# Altium schematic sheet WL-CONTROL.SchDoc
size 420 x 297 mm; Scale: 1:1; DocumentType: Схема электрическая принципиальная; FirstReferrence: UA3REO/R7KBI; DocumentNumber: 9; SheetNumber: 7; SheetTotal: 12
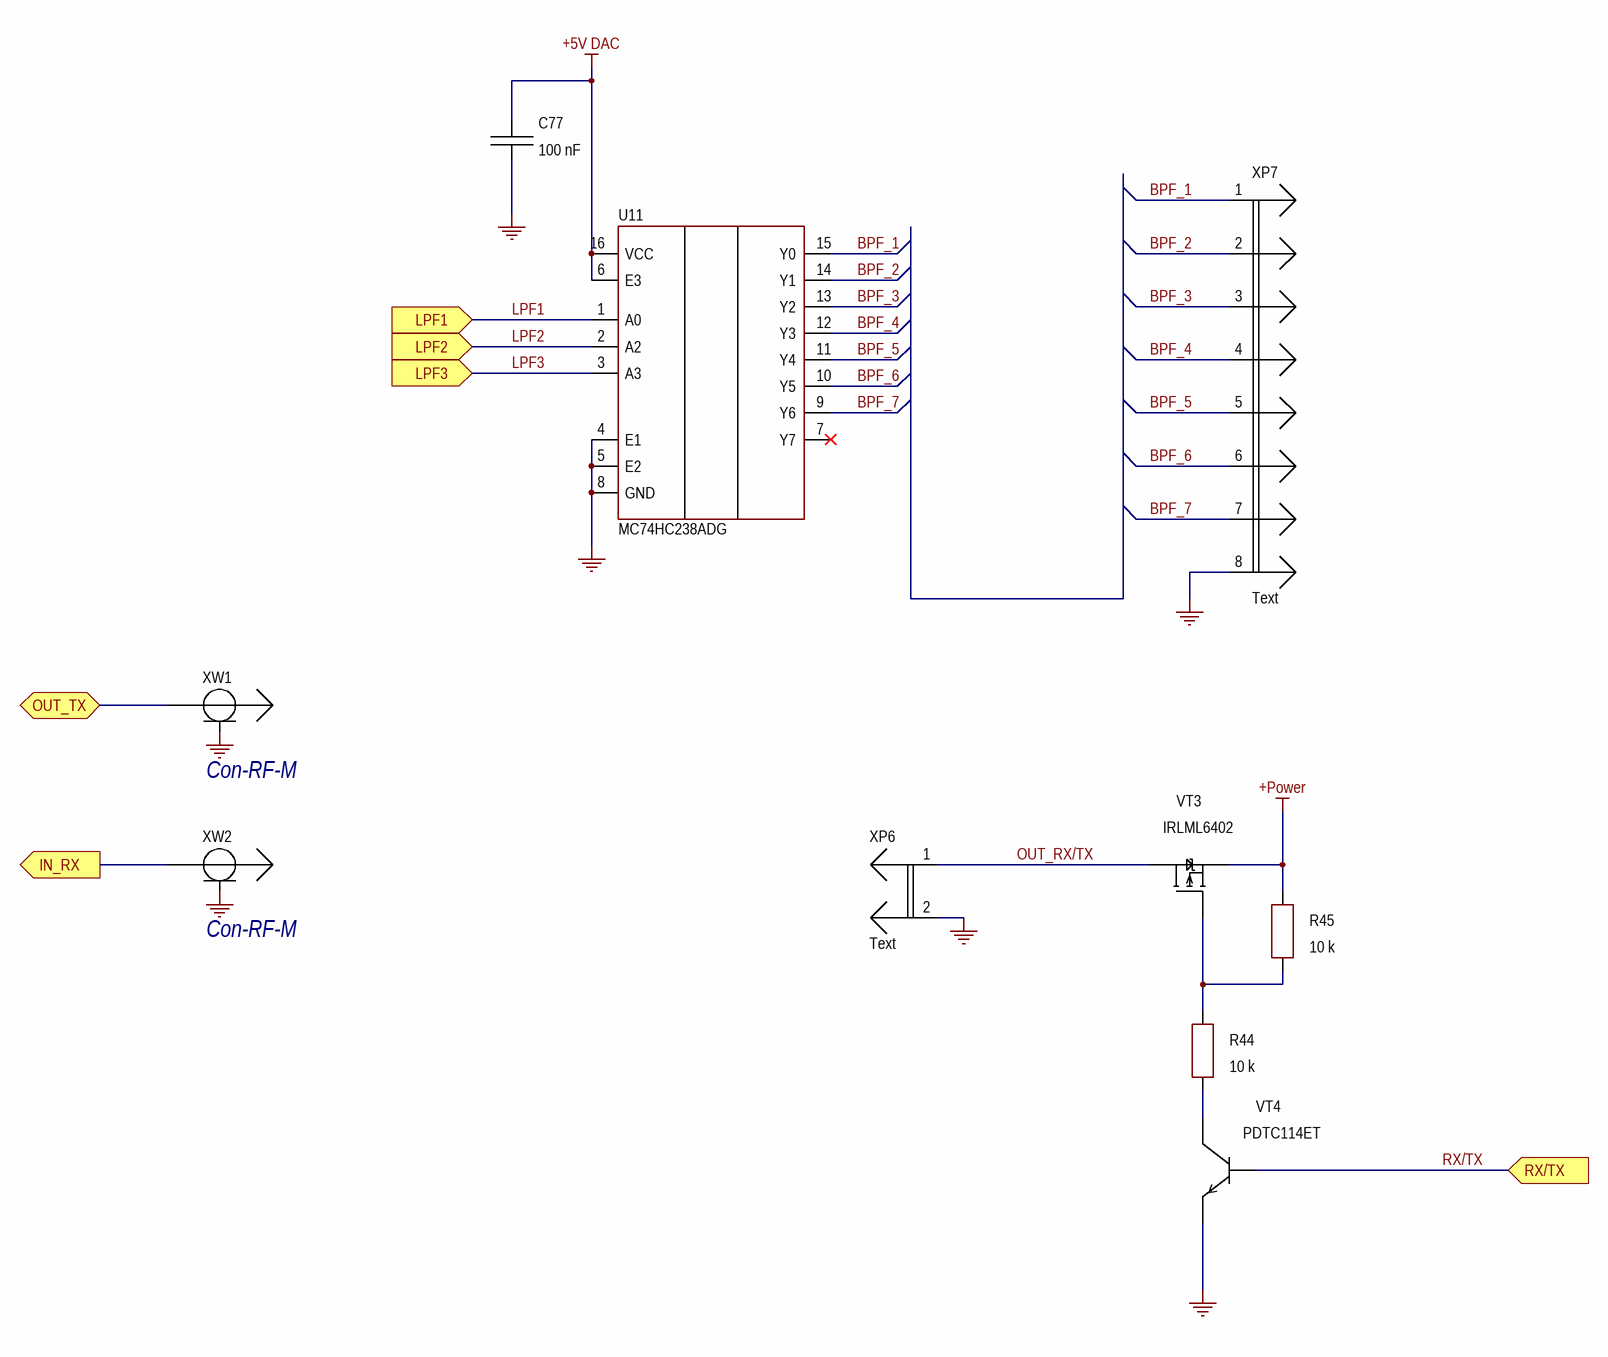
[diagram p0: WL-CONTROL.SchDoc]

## Parts
C77  100 nF  [C-0805-0.95]
R44  10 k  [R-0805]
R45  10 k  [R-0805]
U11  MC74HC238ADG  [SOIC-16]
VT3  IRLML6402  [SOT-23]
VT4  PDTC114ET  [SOT-23]
XP6  Text  [61900211121]
XP7  Text  [CON PLD-8]
XW1  Con-RF-M  [A-1JB]
XW2  Con-RF-M  [A-1JB]

## Ports
IN_RX (out), LPF1 (in), LPF2 (in), LPF3 (in), OUT_TX (bidir), RX/TX (in)

## Nets
+5V DAC: C77.1 U11.6(E3) U11.16(VCC)
+Power: R45.2 VT3.2(S)
GND: C77.2 U11.4(E1) U11.5(E2) U11.8(GND) VT4.2 XP6.2 XP7.8 XW1.2 XW2.2
BPF_1: U11.15(Y0) XP7.1
BPF_2: U11.14(Y1) XP7.2
BPF_3: U11.13(Y2) XP7.3
BPF_4: U11.12(Y3) XP7.4
BPF_5: U11.11(Y4) XP7.5
BPF_6: U11.10(Y5) XP7.6
BPF_7: U11.9(Y6) XP7.7
IN_RX: XW2.1 ; port IN_RX
LPF1: U11.1(A0) ; port LPF1
LPF2: U11.2(A2) ; port LPF2
LPF3: U11.3(A3) ; port LPF3
OUT_RX/TX: VT3.3(D) XP6.1
OUT_TX: XW1.1 ; port OUT_TX
RX/TX: VT4.1 ; port RX/TX
NetR44_1: R44.1 VT4.3
NetR44_2: R44.2 R45.1 VT3.1(G)

Not connected (* = marked no-connect by the designer): U11 7(Y7)*

## Notes on the sheet
- Подп. дата
- Инв. № дубл.
- Взам. инв. №
- Подп. и дата
- Инв. № подл.
- Изм.
- Лист
- № докум.
- Подп.
- Дата
- ALTIUM GOSTBOM2.0 KEV
- Файл:
- Копировал
- Формат А3

## Library data of the parts
C77 = CC0805KRX7R9BB104: Manufacturer: Yageo; Value: 100; Type: Конденсатор; Dielectric: X7R; Tolerance: ±10%; Voltage: 50 V; CommentDOC: ( CC - 0805 - X7R - 50 V - 100 nF ±10% ); Part Number: CC0805KRX7R9BB104; Units: nF; Case: 0805; Operating Temperature: -55 ... 125 °C; Series: CC; Value+Units: 100 nF; ValueSCH: 100 nF; ( Series - Case - Dielectric -  Voltage - Value+Units Tolerance: ( CC - 0805 - X7R - 50 V - 100 nF ±10% )
R44 R45 = RC0805JR-0710KL: Manufacturer: Yageo; Value: 10; Power: 0,125 W; Units: kOhm; Tolerance: ±5%; Operating Voltage: 150 V; Value+Units: 10 kOhm; CommentDOC: ( RC - 0805 - 0,125 W - 10 kOhm  ±5% ); Type: Резистор; Part Number: RC0805JR-0710KL; Case: 0805; Operating Temperature: -55°C ... 155°C; ValueSCH: 10 k; Series: RC
U11 = MC74HC238ADG: IC DECODER/DEMUX 1X3:8; Manufacturer: ON Semiconductor; Voltage  Supply: +2 V … 6 V; Type: Микросхема; Part Number: MC74HC238ADG; Function: IC DECODER/DEMUX 1X3:8; Case: SOIC-16; Operating Temperature: -55 ... 125 °C
VT3 = IRLML6402TRPBF: Manufacturer: Infineon Technologies; Type: Транзистор; D-S Voltage max: 20 V; Drain Current max: 3,7 A; Total Power Dissipation: 1,3 W; Rds On (Max): 65 mOhm; Vgs (Max): ±12 V; Gate Threshold Voltage: 1,2 V; Input Capacitance: 633 pF; Part Number: IRLML6402TRPBF; ValueSCH: IRLML6402; Operating Temperature: -55°C ... 150°C
VT4 = PDTC114ET,215: Manufacturer: Nexperia USA Inc.; Type: Транзистор; Uce max: 50 V; Ice max: 100 mA; Total Power Dissipation: 250 mW; F max: 230 MHz; Part Number: PDTC114ET,215; ValueSCH: PDTC114ET; DC Current Gain: -; Operating Temperature: -65°C …  150°C
XP6 = 61900211121: Manufacturer: Würth Elektronik; Pitch: 2,54 mm; Functional Analog: WF-2; Type: Вилка; Part Number: 61900211121; Series: WE-WTB; Number of Pins: 2; Operating Temperature: −40°C ... 105°C
XP7 = PLD-8: Part Number: PLD-8; Manufacturer: Connfly Electronic Co., Ltd.; Type: Вилка
XW1 XW2 = A-1JB: Manufacturer: Amphenol RF; Gender: Male; Type: Вилка; Part Number: A-1JB; Series: AMC; Mounting Type: Surface Mount; PCB   Thickness: -; Operating Temperature: -40°C ... 90°C